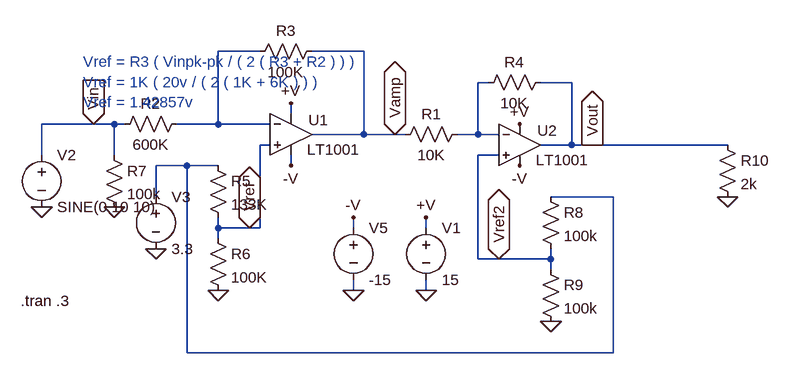
[diagram p0: schematic LTSpice simulation.asc]
LTSpice simulation.asc, the LTspice schematic file:
Version 4
SHEET 1 2168 1300
WIRE 48 64 -16 64
WIRE 208 64 128 64
WIRE 400 112 384 112
WIRE 528 112 480 112
WIRE 96 160 96 144
WIRE -208 176 -288 176
WIRE -176 176 -208 176
WIRE -160 176 -176 176
WIRE -16 176 -16 64
WIRE -16 176 -80 176
WIRE 64 176 -16 176
WIRE 208 192 208 64
WIRE 208 192 128 192
WIRE 256 192 208 192
WIRE 272 192 256 192
WIRE 384 192 384 112
WIRE 384 192 352 192
WIRE 416 192 384 192
WIRE 64 208 48 208
WIRE 528 208 528 112
WIRE 528 208 480 208
WIRE 560 208 528 208
WIRE 768 208 560 208
WIRE -288 224 -288 176
WIRE -176 224 -176 176
WIRE 416 224 384 224
WIRE -64 240 -112 240
WIRE -16 240 -64 240
WIRE 96 240 96 224
WIRE -112 288 -112 240
WIRE 592 288 496 288
WIRE -16 336 -16 320
WIRE 32 336 -16 336
WIRE 48 336 48 208
WIRE 48 336 32 336
WIRE 192 336 192 320
WIRE 304 336 304 320
WIRE -16 352 -16 336
WIRE 384 384 384 224
WIRE 416 384 384 384
WIRE 496 384 496 368
WIRE 496 384 416 384
WIRE 496 400 496 384
WIRE 192 432 192 416
WIRE 304 432 304 416
WIRE -64 528 -64 240
WIRE 592 528 592 288
WIRE 592 528 -64 528
FLAG 304 432 0
FLAG 96 144 +V
FLAG 304 320 +V
FLAG 192 432 0
FLAG 192 320 -V
FLAG 96 240 -V
FLAG -288 304 0
FLAG -208 176 Vin
IOPIN -208 176 In
FLAG -112 368 0
FLAG 256 192 Vamp
IOPIN 256 192 BiDir
FLAG -16 432 0
FLAG 32 336 Vref
IOPIN 32 336 BiDir
FLAG -176 304 0
FLAG 448 240 -V
FLAG 448 176 +V
FLAG 560 208 Vout
IOPIN 560 208 Out
FLAG 496 480 0
FLAG 416 384 Vref2
IOPIN 416 384 BiDir
FLAG 768 288 0
SYMBOL voltage 304 320 R0
WINDOW 123 0 0 Left 2
WINDOW 39 0 0 Left 2
SYMATTR InstName V1
SYMATTR Value 15
SYMBOL res -64 160 R90
WINDOW 0 0 56 VBottom 2
WINDOW 3 32 56 VTop 2
SYMATTR InstName R2
SYMATTR Value 600K
SYMBOL res 144 48 R90
WINDOW 0 0 56 VBottom 2
WINDOW 3 32 56 VTop 2
SYMATTR InstName R3
SYMATTR Value 100K
SYMBOL Opamps\\LT1001 96 128 R0
WINDOW 0 27 42 Left 2
WINDOW 3 25 87 Left 2
SYMATTR InstName U1
SYMBOL voltage 192 320 R0
WINDOW 123 0 0 Left 2
WINDOW 39 0 0 Left 2
SYMATTR InstName V5
SYMATTR Value -15
SYMBOL voltage -288 208 R0
WINDOW 123 0 0 Left 0
WINDOW 39 0 0 Left 0
SYMATTR InstName V2
SYMATTR Value SINE(0 10 10)
SYMBOL voltage -112 272 R0
WINDOW 123 0 0 Left 0
WINDOW 39 0 0 Left 0
SYMATTR InstName V3
SYMATTR Value 3.3
SYMBOL res -32 224 R0
SYMATTR InstName R5
SYMATTR Value 133K
SYMBOL res -32 336 R0
SYMATTR InstName R6
SYMATTR Value 100K
SYMBOL Opamps\\LT1001 448 144 R0
WINDOW 0 27 42 Left 2
WINDOW 3 25 87 Left 2
SYMATTR InstName U2
SYMBOL res 368 176 R90
WINDOW 0 0 56 VBottom 2
WINDOW 3 32 56 VTop 2
SYMATTR InstName R1
SYMATTR Value 10K
SYMBOL res 496 96 R90
WINDOW 0 0 56 VBottom 2
WINDOW 3 32 56 VTop 2
SYMATTR InstName R4
SYMATTR Value 10K
SYMBOL res -192 208 R0
SYMATTR InstName R7
SYMATTR Value 100k
SYMBOL res 480 272 R0
SYMATTR InstName R8
SYMATTR Value 100k
SYMBOL res 480 384 R0
SYMATTR InstName R9
SYMATTR Value 100k
SYMBOL res 752 192 R0
SYMATTR InstName R10
SYMATTR Value 2k
TEXT -320 448 Left 2 !.tran .3
TEXT -224 80 Left 2 ;Vref = R3 ( Vinpk-pk / ( 2 ( R3 + R2 ) ) )\nVref = 1K ( 20v / ( 2 ( 1K + 6K ) ) )\nVref = 1.42857v

The netlist it stands for:
* LTSpice simulation.asc
V1 +V 0 15
R2 N001 Vin 600K
R3 Vamp N001 100K
XU1 Vref N001 +V -V Vamp LT1001  ; pins In+ In- V+ V- OUT
V5 -V 0 -15
V2 Vin 0 SINE(0 10 10)
V3 N003 0 3.3
R5 N003 Vref 133K
R6 Vref 0 100K
XU2 Vref2 N002 +V -V Vout LT1001  ; pins In+ In- V+ V- OUT
R1 N002 Vamp 10K
R4 Vout N002 10K
R7 Vin 0 100k
R8 N003 Vref2 100k
R9 Vref2 0 100k
R10 Vout 0 2k
.tran .3
* Vref = R3 ( Vinpk-pk / ( 2 ( R3 + R2 ) ) )
* Vref = 1K ( 20v / ( 2 ( 1K + 6K ) ) )
* Vref = 1.42857v
.lib LTC.lib
.backanno
.end